# Altium schematic sheet Extension_CN.SchDoc: Arduino/Morphos extension connectors
size A4; Author: Ph.A; SheetNumber: 4; SheetTotal: 6
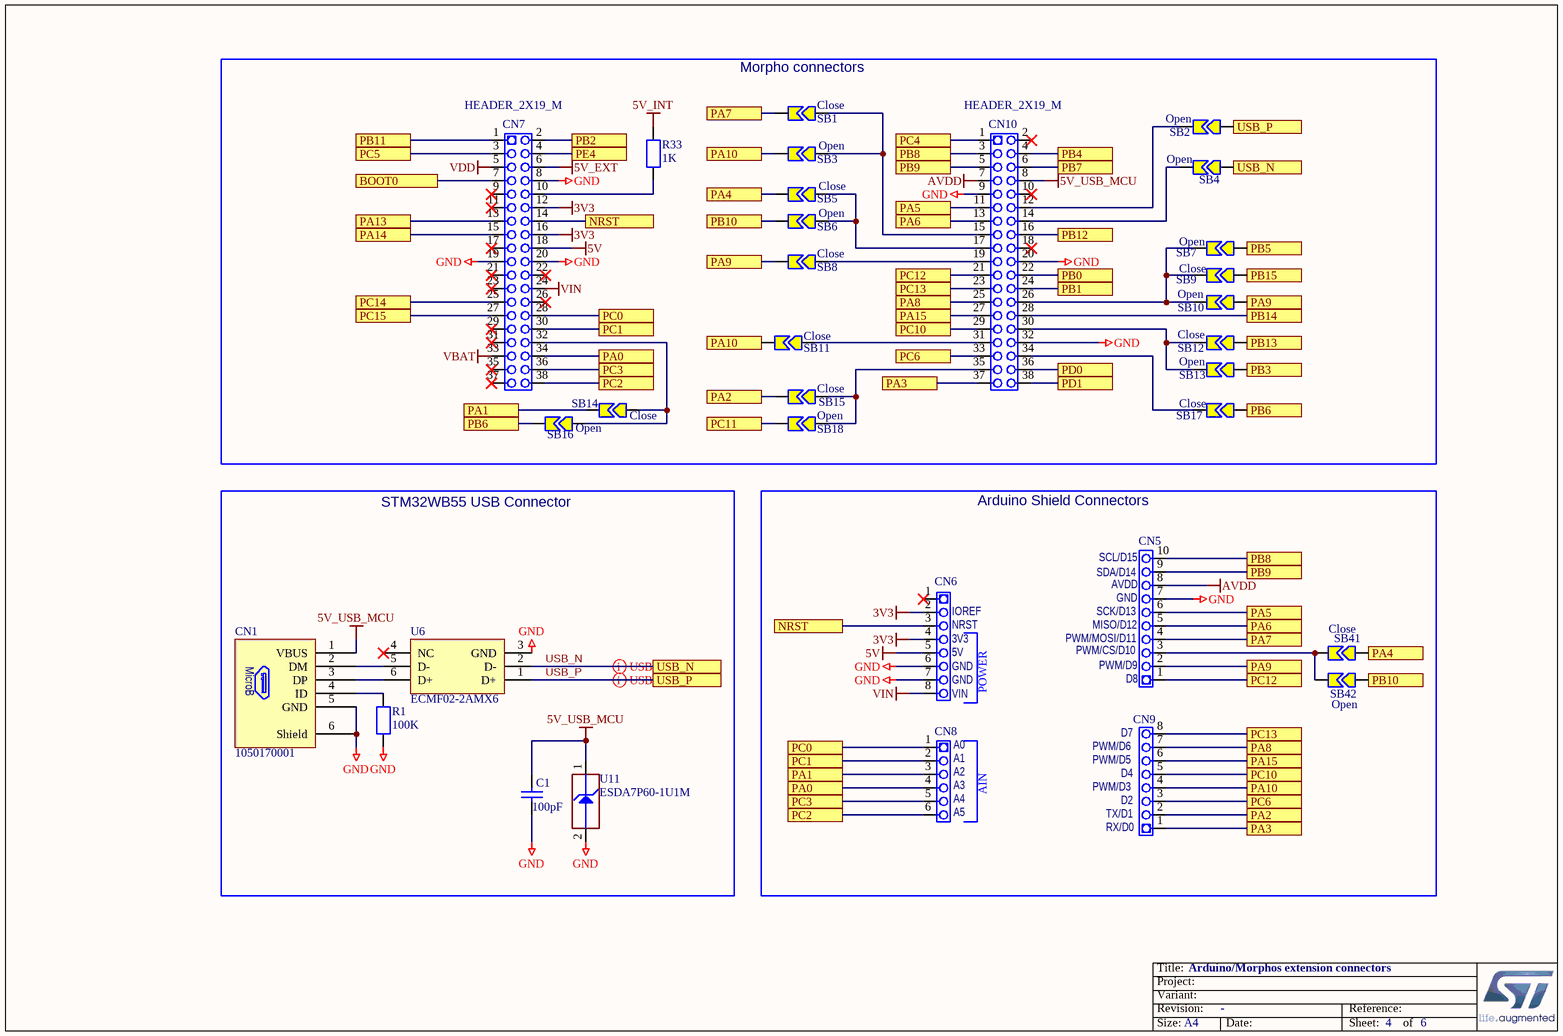
[diagram p0: Extension_CN.SchDoc]

## Parts
C1  value 100pF  [C0402]  (hidden comment: Capacitor)
CN1  1050170001  [USBMICROB_MOLEX_105017-0001_H2P90]
CN5  HEADER_1X10  [Header F 1x10x2.54 TH V]  (value not drawn)
CN6  HEADER_1X8_F  [Header F 1x8x2.54 TH V]  (value not drawn)
CN7  HEADER_2X19_M  [Header M 2x19x2.54 TH M_top + M_bottom]
CN8  HEADER_1X6  [Header F 1x6x2.54 TH V]  (value not drawn)
CN9  HEADER_1X8_F  [Header F 1x8x2.54 TH V]  (value not drawn)
CN10  HEADER_2X19_M  [Header M 2x19x2.54 TH M_top + M_bottom]
R1  100K  [0402_RES]
R33  1K  [0402_RES]
SB1  Close  [SB-tiny]
SB2  Open  [SB-tiny]
SB3  Open  [SB-tiny]
SB4  Open  [SB-tiny]
SB5  Close  [SB-tiny]
SB6  Open  [SB-tiny]
SB7  Open  [SB-tiny]
SB8  Close  [SB-tiny]
SB9  Close  [SB-tiny]
SB10  Open  [SB-tiny]
SB11  Close  [SB-tiny]
SB12  Close  [SB-tiny]
SB13  Open  [SB-tiny]
SB14  Close  [SB-tiny]
SB15  Close  [SB-tiny]
SB16  Open  [SB-tiny]
SB17  Close  [SB-tiny]
SB18  Open  [SB-tiny]
SB41  Close  [SB-tiny]
SB42  Open  [SB-tiny]
U6  ECMF02-2AMX6  [ESD_QFN-6L_1P7X1P5_P050]
U11  value ESDA7P60-1U1M  [ESD_QFN2_1P6X1_P125]  (hidden comment: ESD-TRANSIL)

## Blocks framed on the sheet
Morpho connectors: CN7 CN10 R33 SB1-SB18
STM32WB55 USB Connector: C1 CN1 R1 U6 U11
Arduino Shield Connectors: CN5 CN6 CN8 CN9 SB41 SB42

## Ports
BOOT0, NRST, PA0, PA1, PA2, PA3, PA4, PA5, PA6, PA7, PA8, PA9, PA10, PA13, PA14, PA15, PB0, PB1, PB2, PB3, PB4, PB5, PB6, PB7, PB8, PB9, PB10, PB11, PB12, PB13, PB14, PB15, PC0, PC1, PC2, PC3, PC4, PC5, PC6, PC10, PC11, PC12, PC13, PC14, PC15, PD0, PD1, PE4, USB_N, USB_P

## Nets
3V3: CN6.2 CN6.4 CN7.12 CN7.16
5V: CN6.5 CN7.18
5V_EXT: CN7.6
5V_INT: R33.2
5V_USB_MCU: C1.2 CN1.1(VBUS) CN10.8 U11.1(IO1)
AVDD: CN5.8 CN10.7
GND: C1.1 CN1.5(GND) CN1.6(Shield) CN5.7 CN6.6 CN6.7 CN7.8 CN7.19 CN7.20 CN10.9 CN10.20 CN10.32 R1.1 U6.3(GND) U11.2(GND)
VBAT: CN7.33
VDD: CN7.5
VIN: CN6.8 CN7.24
BOOT0: CN7.7 ; port BOOT0
NRST: CN6.3 CN7.14 ; port NRST
PA0: CN7.34 CN8.4 ; port PA0
PA1: CN8.3 SB14.2 ; port PA1
PA2: CN9.2 SB15.2 ; port PA2
PA3: CN9.1 CN10.37 ; port PA3
PA4: SB5.2 SB41.1 ; port PA4
PA5: CN5.6 CN10.11 ; port PA5
PA6: CN5.5 CN10.13 ; port PA6
PA7: CN5.4 SB1.2 ; port PA7
PA8: CN9.7 CN10.25 ; port PA8
PA9: CN5.2 SB8.2 SB10.1 ; port PA9
PA10: CN9.4 SB3.2 SB11.2 ; port PA10
PA13: CN7.13 ; port PA13
PA14: CN7.15 ; port PA14
PA15: CN9.6 CN10.27 ; port PA15
PB0: CN10.22 ; port PB0
PB1: CN10.24 ; port PB1
PB2: CN7.2 ; port PB2
PB3: SB13.1 ; port PB3
PB4: CN10.4 ; port PB4
PB5: SB7.1 ; port PB5
PB6: SB16.2 SB17.1 ; port PB6
PB7: CN10.6 ; port PB7
PB8: CN5.10 CN10.3 ; port PB8
PB9: CN5.9 CN10.5 ; port PB9
PB10: SB6.2 SB42.1 ; port PB10
PB11: CN7.1 ; port PB11
PB12: CN10.16 ; port PB12
PB13: SB12.1 ; port PB13
PB14: CN10.28 ; port PB14
PB15: SB9.1 ; port PB15
PC0: CN7.28 CN8.1 ; port PC0
PC1: CN7.30 CN8.2 ; port PC1
PC2: CN7.38 CN8.6 ; port PC2
PC3: CN7.36 CN8.5 ; port PC3
PC4: CN10.1 ; port PC4
PC5: CN7.3 ; port PC5
PC6: CN9.3 CN10.33 ; port PC6
PC10: CN9.5 CN10.29 ; port PC10
PC11: SB18.2 ; port PC11
PC12: CN5.1 CN10.21 ; port PC12
PC13: CN9.8 CN10.23 ; port PC13
PC14: CN7.25 ; port PC14
PC15: CN7.27 ; port PC15
PD0: CN10.36 ; port PD0
PD1: CN10.38 ; port PD1
PE4: CN7.4 ; port PE4
USB_N: SB4.1 U6.2(D-) ; port USB_N
USB_P: SB2.1 U6.1(D+) ; port USB_P
NetCN1_2: CN1.2(DM) U6.5(D-)
NetCN1_3: CN1.3(DP) U6.6(D+)
NetCN1_4: CN1.4(ID) R1.2
NetCN5_3: CN5.3 SB41.2 SB42.2
NetCN7_10: CN7.10 R33.1
NetCN7_32: CN7.32 SB14.1 SB16.1
NetCN10_12: CN10.12 SB2.2
NetCN10_14: CN10.14 SB4.2
NetCN10_15: CN10.15 SB1.1 SB3.1
NetCN10_17: CN10.17 SB5.1 SB6.1
NetCN10_19: CN10.19 SB8.1
NetCN10_26: CN10.26 SB7.2 SB9.2 SB10.2
NetCN10_30: CN10.30 SB12.2 SB13.2
NetCN10_31: CN10.31 SB11.1
NetCN10_34: CN10.34 SB17.2
NetCN10_35: CN10.35 SB15.1 SB18.1

Not connected (* = marked no-connect by the designer): CN6 1*; CN7 9* 11* 17* 21* 22* 23* 26* 29* 31* 35* 37*; CN10 2* 10* 18*; U6 4(NC)*

## Layout directives
differential pair; net class DIFF90: USB_N, USB_P

## Notes on the sheet
- (near CN5) SDA/D14
- (near CN5) SCL/D15
- (near CN6) 3V3
- (near CN6) NRST
- (near CN6) IOREF
- (near CN5) PWM/MOSI/D11
- (near CN5) PWM/CS/D10
- (near CN5) MISO/D12
- (near CN5) SCK/D13
- (near CN5) AVDD
- (near CN5) GND
- (near CN6) GND
- (near CN6) VIN
- (near CN6) 5V
- (near CN6) POWER
- (near CN5) PWM/D9
- (near CN5) D8
- (near CN8) A0
- (near CN8) A1
- (near CN8) A2
- (near CN8) A3
- (near CN8) AIN
- (near CN9) PWM/D3
- (near CN9) PWM/D5
- (near CN9) PWM/D6
- (near CN9) D4
- (near CN9) D7
- (near CN8) A5
- (near CN8) A4
- (near CN9) RX/D0
- (near CN9) TX/D1
- (near CN9) D2
- Title:
- Project:
- Size:
- Revision:
- Variant:
- -
- Date:
- Reference:
- Sheet:
- of
- (in symbol 1050170001) MicroB

## Library data of the parts
C1 = MCD-00205: Capacitor, MLCC, 100pF, 50V, NPO, 5%, 0402, T=0,5mm; Manufacturer_Part_Number: CC0402JRNPO9BN101; Manufacturer: YAGEO; ECCN_US: EAR99; ECCN_EU: NEC; Provided_By: SUBCO; Internal_Part_Number: MCD-00205; Status: Released; Part_Type: Capacitor; Package: C0402; ComponentLink1Description: Datasheet; ComponentLink1URL: http://tunmcdsvn.tun.st.com/Component_Datasheet_Library/Trunk/Capacitors/Yageo_Capacitor_NP0_16V-to-50V
CN1 = 1050170001: USB-MICRO-B, 1050170001, SMT, MOLEX; Fitted: YES; Ordered_By: Subcon; ECCN_US/EU: n/a; Manuf_1: MOLEX; Manuf_Part_1: 1050170001; Distrib: DIGIKEY; Value: 1050170001; Order_Code: *
CN6 = HEADER_1X8: Specific Function: Arduino Power
CN7 = HEADER_2X19: Specific Function: Morpho CN7
CN9 = HEADER_1X8: Specific Function: Arduino Digital 1
CN10 = HEADER_2X19: Specific Function: Morpho CN10
R1 R33 = RES: Resistor
SB1-SB18 SB41 SB42 = Strap2: Solder Jumper; Solder: YES; Published: 24-Mar-1999; Revision: July-2002: Re-released for DXP Platform.; Publisher: Altium Limited
U6 = MCD-00649: Common mode filter with ESD protection for USB 2.0 interface; Part_Type: Diode; Manufacturer: STMICROELECTRONICS; BMS_Part_Number: 9151138; ECCN_US: EAR99; ECCN_EU: NEC; Provided_By: SUBCO with ST control; Internal_Part_Number: MCD-00649; Value: ECMF02-2AMX6; Status: Released; Manufacturer_Part_Number: ECMF02-2AMX6; ComponentLink1Description: Datasheet; ComponentLink1URL: http://tunmcdsvn.tun.st.com/Component_Datasheet_Library/Trunk/Diodes/STM_ESD_ECMF02-2AMX6
U11 = MCD-00251: High power transient voltage suppressor, 7V breakdown; Part_Type: Diode; Manufacturer: STMICROELECTRONICS; BMS_Part_Number: 9179042; ECCN_US: EAR99; ECCN_EU: NEC; Provided_By: SUBCO with ST control; Internal_Part_Number: MCD-00251; Status: Released; Manufacturer_Part_Number: ESDA7P60-1U1M; ComponentLink1Description: Datasheet; ComponentLink1URL: http://tunmcdsvn.tun.st.com/Component_Datasheet_Library/Trunk/Diodes/STM_ESD_ESDA7P60-1U1M